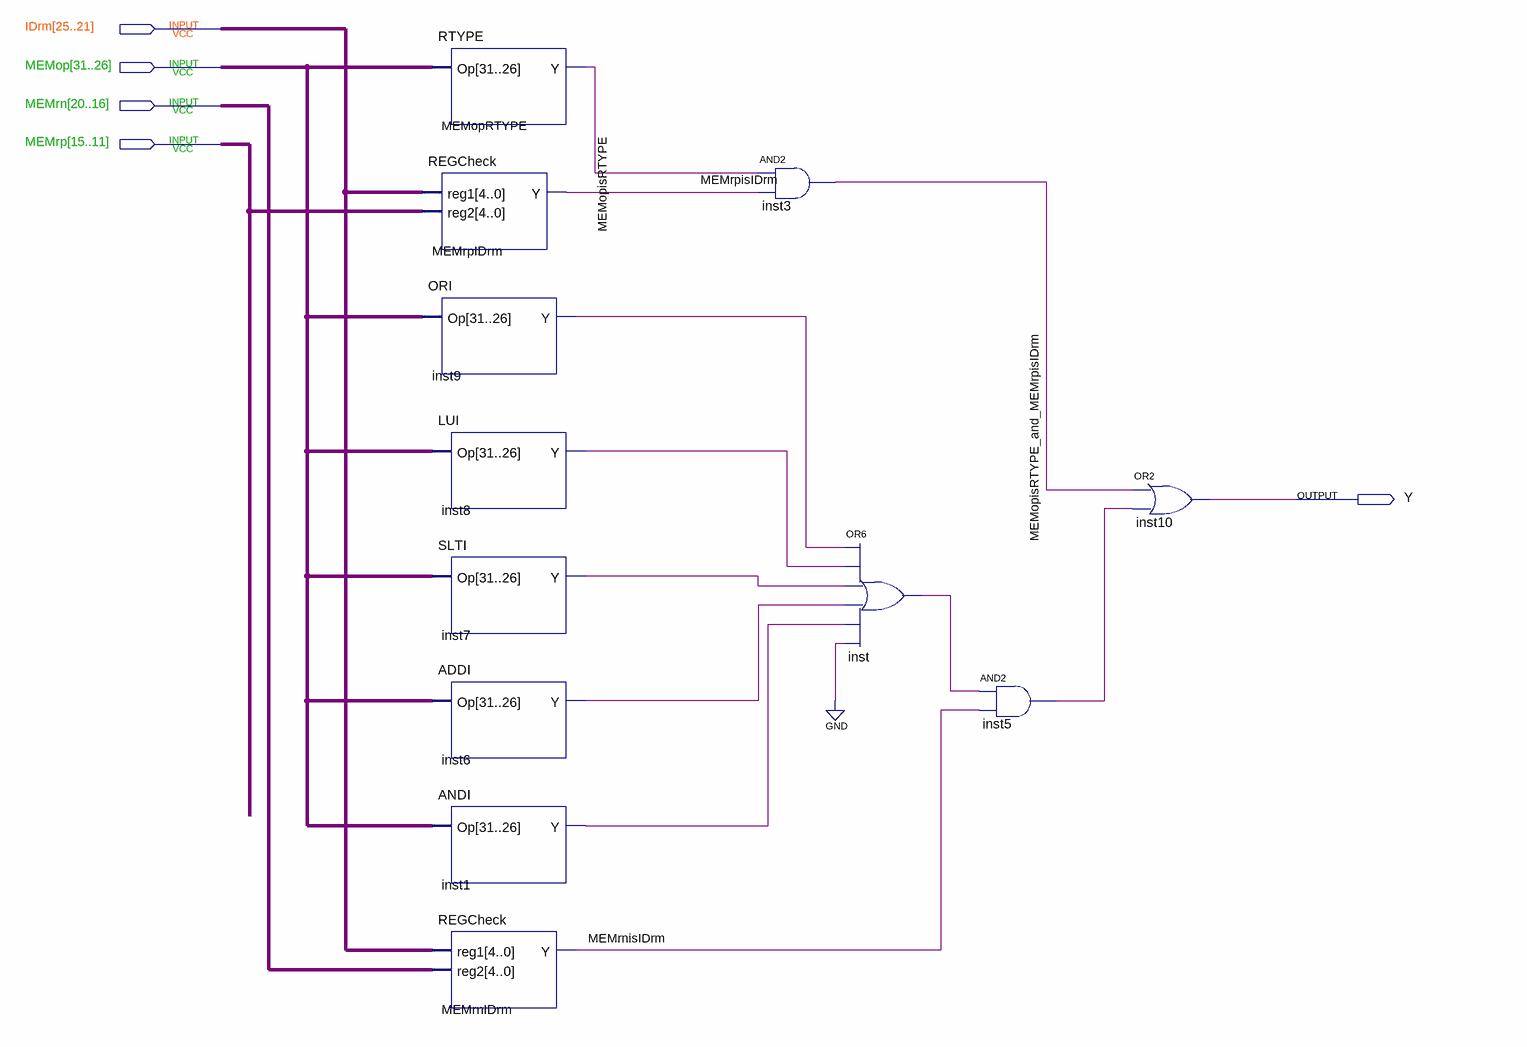
[diagram p0: schematic sheet]
// Quartus schematic ForwardAfromMEMtoID.bdf as structural Verilog: 12 symbols, 5 pins
module ForwardAfromMEMtoID (
  input  [25:21] IDrm,
  input  [31:26] MEMop,
  input  [20:16] MEMrn,
  input  [15:11] MEMrp,
  output Y
);

  wire inst1_y, inst5_out, inst6_y, inst7_y, inst8_y, inst9_y, inst_out, MEMopisRTYPE,
       MEMopisRTYPE_and_MEMrpisIDrm, MEMrnisIDrm, MEMrpisIDrm;

  RTYPE MEMopRTYPE (.Op(MEMop), .Y(MEMopisRTYPE));
  REGCheck MEMrpIDrm (.reg1(IDrm), .reg2(MEMrp), .Y(MEMrpisIDrm));
  ORI inst9 (.Op(MEMop), .Y(inst9_y));
  LUI inst8 (.Op(MEMop), .Y(inst8_y));
  SLTI inst7 (.Op(MEMop), .Y(inst7_y));
  ADDI inst6 (.Op(MEMop), .Y(inst6_y));
  ANDI inst1 (.Op(MEMop), .Y(inst1_y));
  REGCheck MEMrnIDrm (.reg1(IDrm), .reg2(MEMrn), .Y(MEMrnisIDrm));
  and inst3 (MEMopisRTYPE_and_MEMrpisIDrm, MEMopisRTYPE, MEMrpisIDrm);
  or inst (inst_out, inst9_y, inst8_y, inst7_y, inst6_y, inst1_y, 1'b0);
  and inst5 (inst5_out, inst_out, MEMrnisIDrm);
  or inst10 (Y, MEMopisRTYPE_and_MEMrpisIDrm, inst5_out);
endmodule
